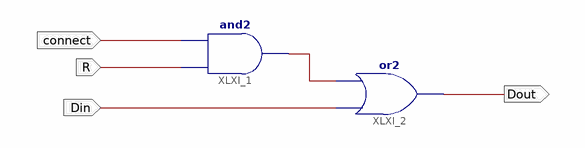
[diagram p0: schematic sheet 1]
// Xilinx ISE schematic connecteur.sch (spartan3e) as structural Verilog: 2 symbols, 4 ports
module connecteur (
  input  Din,
  input  R,
  input  connect,
  output Dout
);

  wire XLXN_1;

  and XLXI_1 (XLXN_1, R, connect);
  or XLXI_2 (Dout, Din, XLXN_1);
endmodule
